# Altium project GNSS_Compass.PrjPcb
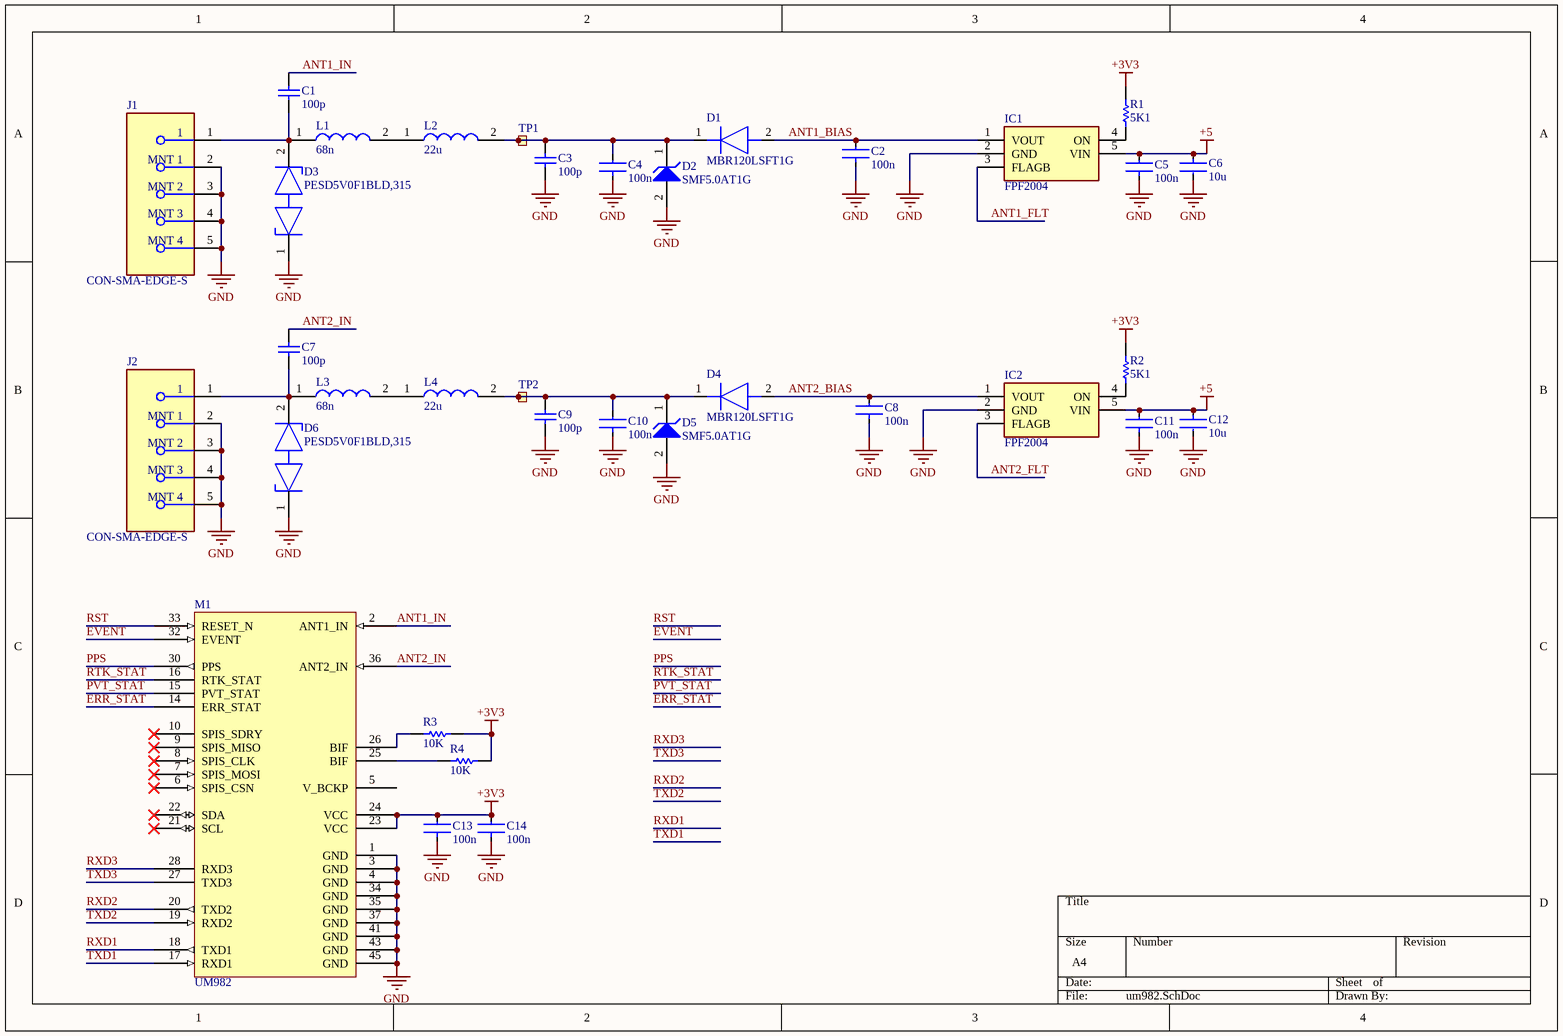
[diagram p0: um982.SchDoc]
3 sheets, 39 parts. Net scope: global (net labels, ports and power ports of the same name join across sheets).
Board file: um982.PcbDoc
Sheets:
  um982.SchDoc
  Sheet1.SchDoc
  IMU.SchDoc

## Sheet um982.SchDoc
size A4; SheetNumber: 1; SheetTotal: 3

### Parts
C1  value 100p  [CAPC1005X55X25ML05T10]  (hidden comment: GRM1555C1H101JA01D)
C2  value 100n  [FP-C1005-050-0_05-IPC_C]  (hidden comment: C1005X7R1H104K050BB)
C3  value 100p  [CAPC1005X55X25ML05T10]  (hidden comment: GRM1555C1H101JA01D)
C4  value 100n  [FP-C1005-050-0_05-IPC_A]  (hidden comment: C1005X7R1H104K050BB)
C5  value 100n  [FP-C1005-050-0_05-IPC_C]  (hidden comment: C1005X7R1H104K050BB)
C6  value 10u  [FP-C1608-080-IPC_A]  (hidden comment: C1608X5R1E106M080AC)
C7  value 100p  [CAPC1005X55X25ML05T10]  (hidden comment: GRM1555C1H101JA01D)
C8  value 100n  [FP-C1005-050-0_05-IPC_C]  (hidden comment: C1005X7R1H104K050BB)
C9  value 100p  [CAPC1005X55X25ML05T10]  (hidden comment: GRM1555C1H101JA01D)
C10  value 100n  [FP-C1005-050-0_05-IPC_A]  (hidden comment: C1005X7R1H104K050BB)
C11  value 100n  [FP-C1005-050-0_05-IPC_C]  (hidden comment: C1005X7R1H104K050BB)
C12  value 10u  [FP-C1608-080-IPC_A]  (hidden comment: C1608X5R1E106M080AC)
C13  value 100n  [FP-C1005-050-0_05-IPC_A]  (hidden comment: C1005X7R1H104K050BB)
C14  value 100n  [FP-C1005-050-0_05-IPC_A]  (hidden comment: C1005X7R1H104K050BB)
D1  MBR120LSFT1G  [SODFL3616X98N]
D2  SMF5.0AT1G  [ONSC-SOD-123FL-2-498_V]
D3  PESD5V0F1BLD,315  [FP-SOD882D-MFG]
D4  MBR120LSFT1G  [SODFL3616X98N]
D5  SMF5.0AT1G  [ONSC-SOD-123FL-2-498_V]
D6  PESD5V0F1BLD,315  [FP-SOD882D-MFG]
IC1  FPF2004  [SOT65P210X110-5N]
IC2  FPF2004  [SOT65P210X110-5N]
J1  CON-SMA-EDGE-S  [FP-CON-SMA-EDGE-S-MFG]
J2  CON-SMA-EDGE-S  [FP-CON-SMA-EDGE-S-MFG]
L1  value 68n  [LQG15WH0N7B02D]  (hidden comment: LQG15HS68NJ02D)
L2  value 22u  [INDM4532X340N]  (hidden comment: NL453232T-220J-PF)
L3  value 68n  [LQG15WH0N7B02D]  (hidden comment: LQG15HS68NJ02D)
L4  value 22u  [INDM4532X340N]  (hidden comment: NL453232T-220J-PF)
M1  UM982  [UM982]
R1  value 5K1  [RESC1005X40X25NL05T10]  (hidden comment: RC0402FR-075K1L)
R2  value 5K1  [RESC1005X40X25NL05T10]  (hidden comment: RC0402FR-075K1L)
R3  value 10K  [RESC1005X40X25LL05T10]  (hidden comment: RC0402FR-0710KL)
R4  value 10K  [RESC1005X40X25LL05T10]  (hidden comment: RC0402FR-0710KL)
TP1  Ø1.0mm,SMD  [TP_SMD_Ø1.0mm]  (value not drawn)  (no BOM)
TP2  Ø1.0mm,SMD  [TP_SMD_Ø1.0mm]  (value not drawn)  (no BOM)

### Nets
+3V3: C13.2 C14.2 M1.23(VCC) M1.24(VCC) R1.1 R2.1 R3.1 R4.1
+5: C5.2 C6.1 C11.2 C12.1 IC1.5(VIN) IC2.5(VIN)
GND: C2.1 C3.2 C4.1 C5.1 C6.2 C8.1 C9.2 C10.1 C11.1 C12.2 C13.1 C14.1 D2.2(A) D3.1(cathode(diode_1)) D5.2(A) D6.1(cathode(diode_1)) IC1.2(GND) IC2.2(GND) J1.2(MNT_1) J1.3(MNT_2) J1.4(MNT_3) J1.5(MNT_4) J2.2(MNT_1) J2.3(MNT_2) J2.4(MNT_3) J2.5(MNT_4) M1.1(GND) M1.3(GND) M1.4(GND) M1.34(GND) M1.35(GND) M1.37(GND) M1.41(GND) M1.43(GND) M1.45(GND)
ANT1_BIAS: C2.2 D1.2(A) IC1.1(VOUT)
ANT1_FLT: IC1.3(FLAGB)
ANT1_IN: C1.2 M1.2(ANT1_IN)
ANT2_BIAS: C8.2 D4.2(A) IC2.1(VOUT)
ANT2_FLT: IC2.3(FLAGB)
ANT2_IN: C7.2 M1.36(ANT2_IN)
ERR_STAT: M1.14(ERR_STAT)
EVENT: M1.32(EVENT)
PPS: M1.30(PPS)
PVT_STAT: M1.15(PVT_STAT)
RST: M1.33(RESET_N)
RTK_STAT: M1.16(RTK_STAT)
RXD1: M1.18(TXD1)
RXD2: M1.20(TXD2)
RXD3: M1.28(RXD3)
TXD1: M1.17(RXD1)
TXD2: M1.19(RXD2)
TXD3: M1.27(TXD3)
NetC1_1: C1.1 D3.2(cathode(diode_2)) J1.1 L1.1
NetC3_1: C3.1 C4.2 D1.1(K) D2.1(K) L2.2 TP1.1
NetC7_1: C7.1 D6.2(cathode(diode_2)) J2.1 L3.1
NetC9_1: C9.1 C10.2 D4.1(K) D5.1(K) L4.2 TP2.1
NetIC1_4: IC1.4(ON) R1.2
NetIC2_4: IC2.4(ON) R2.2
NetL1_2: L1.2 L2.1
NetL3_2: L3.2 L4.1
NetM1_25: M1.25(BIF) R4.2
NetM1_26: M1.26(BIF) R3.2

Not connected (* = marked no-connect by the designer): M1 5(V_BCKP) 6(SPIS_CSN)* 7(SPIS_MOSI)* 8(SPIS_CLK)* 9(SPIS_MISO)* 10(SPIS_SDRY)* 21(SCL)* 22(SDA)*

### Library data of the parts
C1 C3 C7 C9 = CMP-2008-03915-1: Manufacturer: Murata; Part Number: GRM1555C1H101JA01D
C2 C4 C5 C8 C10 C11 C13 C14 = CMP-2000-05393-2: Multilayer Ceramic Capacitors 100nF ±10% 50V X7R SMD 0402; Voltage: 50V; Dielectric Material: Ceramic; Min Operating Temperature: -55°C; Depth: 0.5mm; Radiation Hardening: No; RoHS Compliant: Yes; Voltage Rating (DC): 50V; Lead Free: Lead Free; Resistor Type: Ceramic; Height: 0.5mm; Dielectric: X7R; Thickness: 0.022inch; Case/Package: 0402; Case Code (Metric): 1005; Termination: SMD/SMT; Capacitance: 100nF; Packaging: Tape and Reel; Max Operating Temperature: 125°C; Mount: Surface Mount; Package Quantity: 1; Width: 0.02inch; Weight: 2.3E-05oz; Voltage Rating: 50V; Tolerance: 10%; Construction: Flat; Case Code (Imperial): 0402; Length: 1mm; REACH SVHC: No SVHC; Series: C
C6 C12 = CMP-2000-05442-2: CAP CER 10UF 25V X5R 0603; Dielectric Material: Ceramic; Tolerance: 20%; Dielectric: X5R; Length: 1.6mm; Termination: SMD/SMT; Depth: 0.8mm; RoHS Compliant: Yes; Construction: Flat; Weight: 7.1E-05oz; Thickness: 0.039inch; Packaging: Tape and Reel; Min Operating Temperature: -55°C; Case Code (Imperial): 0603; Case/Package: 0603; Height: 0.8mm; Case Code (Metric): 1608; Voltage Rating: 25V; Resistor Type: Ceramic; Voltage Rating (DC): 25V; Max Operating Temperature: 85°C; REACH SVHC: No SVHC; Lead Free: Lead Free; Series: C; Width: 0.8mm; Mount: Surface Mount; Package Quantity: 1; Capacitance: 10uF
D1 D4 = MBR120LSFT1G: Diode; Manufacturer_Name: onsemi; Datasheet Link: https://www.onsemi.com/pub/Collateral/MBR120LSFT1-D.PDF; Height: 0.98mm; Manufacturer_Part_Number: MBR120LSFT1G; Mouser Part Number: 863-MBR120LSFT1G; Mouser Price/Stock: https://www.mouser.co.uk/ProductDetail/onsemi/MBR120LSFT1G?qs=3JMERSakebpX1t8rvRkaxg%3D%3D; Arrow Part Number: MBR120LSFT1G; Arrow Price/Stock: https://www.arrow.com/en/products/mbr120lsft1g/on-semiconductor?utm_currency=USD&region=nac
D2 D5 = CMP-1061-00612-1: 200 W Transient Voltage Suppressor, 2-Pin SOD-123FL, Pb-Free, Tape and Reel; Manufacturer: On Semiconductor; Direction: Unidirectional; IR Max (uA): 400; V(BR) Typ (V): 6.7; PackageDescription: 2-Pin SOD, Body 1.65 x 2.7 mm; PartNumber: SMF5.0AT1G; ComponentLink3Description: Package Specification; ComponentLink3URL: http://www.onsemi.com/pub_link/Collateral/498-01.PDF; PackageVersion: Rev. D, 05/2013; Mounting Technology: Surface Mount; PackageReference: SOD-123FL-2-498; ComponentLink2URL: http://www.onsemi.com/pub_link/Collateral/SMF5.0AT1-D.PDF; DatasheetVersion: Rev. 7; ComponentLink1Description: Manufacturer URL; Packing: Tape and Reel; RoHS: Pb-Free; ComponentLink1URL: http://www.onsemi.com/; ComponentLink2Description: Datasheet
D3 D6 = CMP-14432-000003-1: TVS DIODE 5.5V 15V 2DFN1006D; RoHS Compliant: Yes
IC1 IC2 = FPF2004: Integrated Circuit; Manufacturer_Name: onsemi; Datasheet Link: https://www.onsemi.com/pub/Collateral/FPF2001-D.PDF; Height: 1.1mm; Manufacturer_Part_Number: FPF2004; Mouser Part Number: 512-FPF2004; Mouser Price/Stock: https://www.mouser.co.uk/ProductDetail/onsemi-Fairchild/FPF2004?qs=lYuAOLy5nvYlXtSUPYB80A%3D%3D; Arrow Part Number: FPF2004; Arrow Price/Stock: https://www.arrow.com/en/products/fpf2004/on-semiconductor
J1 J2 = CMP-204357-000001-1: CONN SMA JACK STR EDGE MNT; Manufacturer: RF Solutions Ltd.; Impedance: 50Ω; Conn Orientation: Right Angle; Is Female: yes; Number Of Contacts: 1; Frequency: 18GHz; Shielding: true; Category: Conn; ComponentLink2URL: https://www.rfsolutions.co.uk/downloads/1498648656DS-CON-EDGE-SMA-4.pdf; Octopart: https://octopart.com/con-sma-edge-s-rf+solutions-70967450; Package: CONN_JACK; Manufacturer Part Number: CON-SMA-EDGE-S; Height: 6.35mm; Device Class L1: Connectors; Footprint Url: https://forum.upverter.com/uploads/default/original/3X/b/e/be75b907af57498775929d6d9099689c472e0307.pdf; Contact Material: Gold; ComponentLink2Description: Datasheet; Device Class L2: RF / Coaxial Connectors; RoHS: TRUE; Device Class L3: unset; Digikey Description: CONN SMA JACK STR EDGE MNT; Lead Free: Yes; Automotive: No
L1 L3 = LQG15HS68NJ02D: Inductor; Manufacturer_Name: Murata Electronics; Datasheet Link: https://search.murata.co.jp/Ceramy/image/img/P02/JELF243B-0010.pdf; Height: 0.6mm; Manufacturer_Part_Number: LQG15HS68NJ02D; Mouser Part Number: 81-LQG15HS68NJ02D; Mouser Price/Stock: https://www.mouser.co.uk/ProductDetail/Murata-Electronics/LQG15HS68NJ02D?qs=%252BvdzeT3otYvc8aHGlFkb4Q%3D%3D; Arrow Part Number: LQG15HS68NJ02D; Arrow Price/Stock: https://www.arrow.com/en/products/lqg15hs68nj02d/murata-manufacturing?region=nac
L2 L4 = NL453232T-220J-PF: Inductor; Manufacturer_Name: TDK; Datasheet Link: https://product.tdk.com/system/files/dam/doc/product/inductor/inductor/smd/catalog/inductor_commercial_standard_nl453232_en.pdf; Height: 3.4mm; Manufacturer_Part_Number: NL453232T-220J-PF; Mouser Part Number: 810-NL453232T-220JPF; Mouser Price/Stock: https://www.mouser.co.uk/ProductDetail/TDK/NL453232T-220J-PF?qs=qikLf3I1oVVds9cZ5k413A%3D%3D; Arrow Part Number: NL453232T-220J-PF; Arrow Price/Stock: https://www.arrow.com/en/products/nl453232t-220j-pf/tdk
M1 = UM982: All-constellation Multi-frequencyHigh Precision Positioning & Heading Module
R1 R2 = CMP-2002-07753-1: Manufacturer: Yageo / Phycomp; Part Number: RC0402FR-075K1L
R3 R4 = CMP-2002-07353-1: Manufacturer: Yageo / Phycomp; Part Number: RC0402FR-0710KL
TP1 TP2 = TP_SMD_Ø1.0MM: 1.0mm circular SMD testpad; Manufacturer: Nordic Semiconductor; Manufacturer Part Number: N.A.; Pad Count: 1; Part Number: TP_SMD_Ø1.0MM; LatestRevisionDate: 2013-06-11; Published: 2013-06-11; Value: Ø1.0mm,SMD; Note: N.A.; Artikkelnr Noca: N.A.; Footprint Doc: TP_SMD_Ø1.0mm; Part number IPS: N.A.; ComponentLink1URL: N.A.; ComponentLink1Description: Datasheet; ComponentLink2URL: N.A.; ComponentLink2Description: Supplier link; HelpURL: N.A.; Supplier 1: N.A.; Supplier Part Number 1: N.A.; Supplier 2: N.A.; Supplier Part Number 2: N.A.; Component Class: Connectors; PartId: 100500475

## Sheet Sheet1.SchDoc
size A; SheetNumber: 2; SheetTotal: 3

## Sheet IMU.SchDoc
size A; SheetNumber: 3; SheetTotal: 3
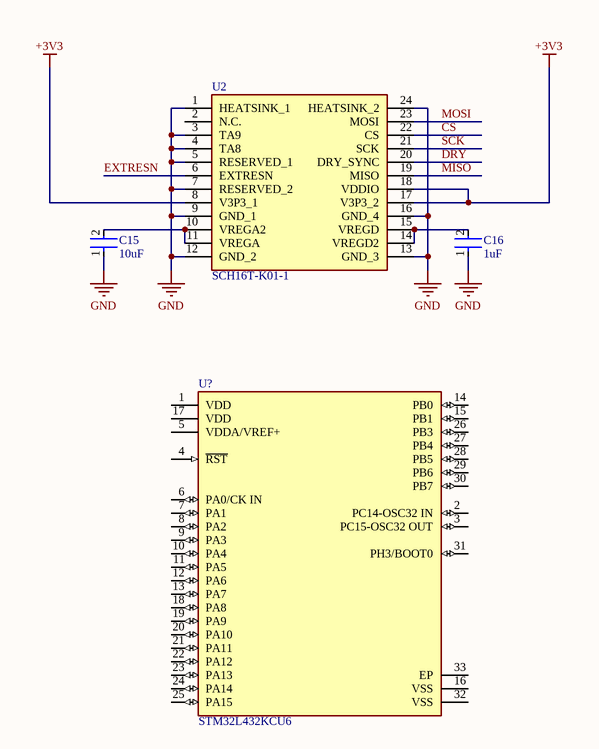
[diagram p1: IMU.SchDoc]

### Parts
C15  Capacitance: 10uF  [FP-C1608-080-IPC_A]  (hidden comment: C1608X5R1E106M080AC)
C16  Capacitance: 1uF  [FP-C1005-050-0_05-IPC_B]  (hidden comment: C1005X5R1E105K050BC)
U2  SCH16T-K01-1  [SCH16TK011]
U?  STM32L432KCU6  [FP-UFQFPN32-A0B8-MFG]

### Nets
+3V3: U2.8(V3P3_1) U2.17(V3P3_2) U2.18(VDDIO)
GND: C15.1 C16.1 U2.1(HEATSINK_1) U2.3(TA9) U2.4(TA8) U2.5(RESERVED_1) U2.7(RESERVED_2) U2.9(GND_1) U2.12(GND_2) U2.13(GND_3) U2.16(GND_4) U2.24(HEATSINK_2)
CS: U2.22(CS)
DRY: U2.20(DRY_SYNC)
EXTRESN: U2.6(EXTRESN)
MISO: U2.19(MISO)
MOSI: U2.23(MOSI)
SCK: U2.21(SCK)
NetC15_2: C15.2 U2.10(VREGA2) U2.11(VREGA)
NetC16_2: C16.2 U2.14(VREGD2) U2.15(VREGD)

Not connected (* = marked no-connect by the designer): U2 2(N.C.); U? 1(VDD) 2(PC14-OSC32_IN) 3(PC15-OSC32_OUT) 4(~{RST}) 5(VDDA/VREF+) 6(PA0/CK_IN) 7(PA1) 8(PA2) 9(PA3) 10(PA4) 11(PA5) 12(PA6) 13(PA7) 14(PB0) 15(PB1) 16(VSS) 17(VDD) 18(PA8) 19(PA9) 20(PA10) 21(PA11) 22(PA12) 23(PA13) 24(PA14) 25(PA15) 26(PB3) 27(PB4) 28(PB5) 29(PB6) 30(PB7) 31(PH3/BOOT0) 32(VSS) 33(EP)

### Library data of the parts
C15 = CMP-2000-05442-2: as C6 on sheet um982; Dielectric: X5R; Length: 1.6mm; Termination: SMD/SMT; Depth: 0.8mm; RoHS Compliant: Yes; Construction: Flat; Weight: 7.1E-05oz; Thickness: 0.039inch; Packaging: Tape and Reel; Min Operating Temperature: -55°C; Case Code (Imperial): 0603; Case/Package: 0603; Height: 0.8mm; Case Code (Metric): 1608; Voltage Rating: 25V; Resistor Type: Ceramic; Voltage Rating (DC): 25V; Max Operating Temperature: 85°C; REACH SVHC: No SVHC; Lead Free: Lead Free; Series: C; Width: 0.8mm; Mount: Surface Mount; Package Quantity: 1
C16 = CMP-2000-06001-2: Multilayer Ceramic Capacitors 1μF ±10% 25V X5R SMD 0402; Package Quantity: 1; Radiation Hardening: No; Dielectric: X5R; REACH SVHC: No SVHC; RoHS Compliant: Yes; Case Code (Imperial): 0402; Voltage Rating: 25V; Termination: SMD/SMT; Max Operating Temperature: 85°C; Series: C; Packaging: Tape and Reel; Tolerance: 10%; Voltage Rating (DC): 25V; Weight: 2.3E-05oz; Height: 0.5mm; Resistor Type: Ceramic; Thickness: 0.022inch; Min Operating Temperature: -55°C; Length: 1mm; Lead Free: Lead Free; Depth: 0.5mm; Dielectric Material: Ceramic; Width: 0.02inch; Case/Package: 0402; Case Code (Metric): 1005; Mount: Surface Mount
U2 = SCH16T-K01-1: Undefined or Miscellaneous; Manufacturer_Name: Murata Electronics; Datasheet Link: https://www.murata.com/-/media/webrenewal/products/sensor/pdf/datasheet/datasheet-sch16t-series-short.ashx?la=en-us&cvid=20240110024121000000; Height: 3mm; Manufacturer_Part_Number: SCH16T-K01-1; Mouser Part Number: 81-SCH16T-K01-1; Mouser Price/Stock: https://www.mouser.co.uk/ProductDetail/Murata-Electronics/SCH16T-K01-1?qs=HFfMDpzxxd0hctvcENbFhg%3D%3D; Arrow Part Number: SCH16T-K01-1; Arrow Price/Stock: https://www.arrow.com/en/products/sch16t-k01-1/murata-manufacturing?utm_currency=USD&region=nac
U? = CMP-12105-000033-1: IC MCU 32BIT 256KB FLASH 32QFPN; Manufacturer: STMicroelectronics; Max Supply Voltage: 3.6V; Number Of Timers/Counters: 11; Ram Size: 64KBytes; Number Of Usb Channels: 1; Memory Size: 256KBytes; Number Of Uart Channels: 3; Frequency: 80MHz; Number Of I2C Channels: 2; Core Architecture: ARM Cortex-M4; Number Of I/Os: 26; Min Supply Voltage: 1.62V; Data Bus Width: 32bits; Max Junction Temp: +105°C; Interface: I2C,SPI,UART,USART,CAN,USB,LIN,IrDA,Other; Ambient Temperature Range High: +85°C; Category: IC; Device Class L2: Embedded Processors and Controllers; Ambient Temperature Range Low: -40°C; Number Of Adc Channels: 11; ComponentLink2Description: Datasheet; Number Of A/D Converters: 1; Device Class L1: Integrated Circuits (ICs); Memory Type: FLASH; Height: 0.6mm; Temperature: -40°C to +105°C; Automotive: No; Temperature Range Low: -40°C; Digikey Description: IC MCU 32BIT 256KB FLASH 32QFPN; Manufacturer Part Number: STM32L432KCU6; Temperature Range High: +105°C; Octopart: https://octopart.com/stm32l432kcu6-stmicroelectronics-71093510; Device Class L3: Microcontrollers; Number Of Pwm Channels: 1; Number Of Spi Channels: 2; Lead Free: Yes; Number Of Cores: 1; Package: UFQFPN32-A0B8; ComponentLink2URL: https://www.st.com/content/ccc/resource/technical/document/datasheet/24/01/9f/59/f0/83/47/fc/DM00257205.pdf/files/DM00257205.pdf/jcr:content/translations/en.DM00257205.pdf; RoHS: TRUE

## Nets that join several sheets
+3V3: um982 (8 pins), IMU (U2.8 U2.17 U2.18)
GND: um982 (35 pins), IMU (12 pins)